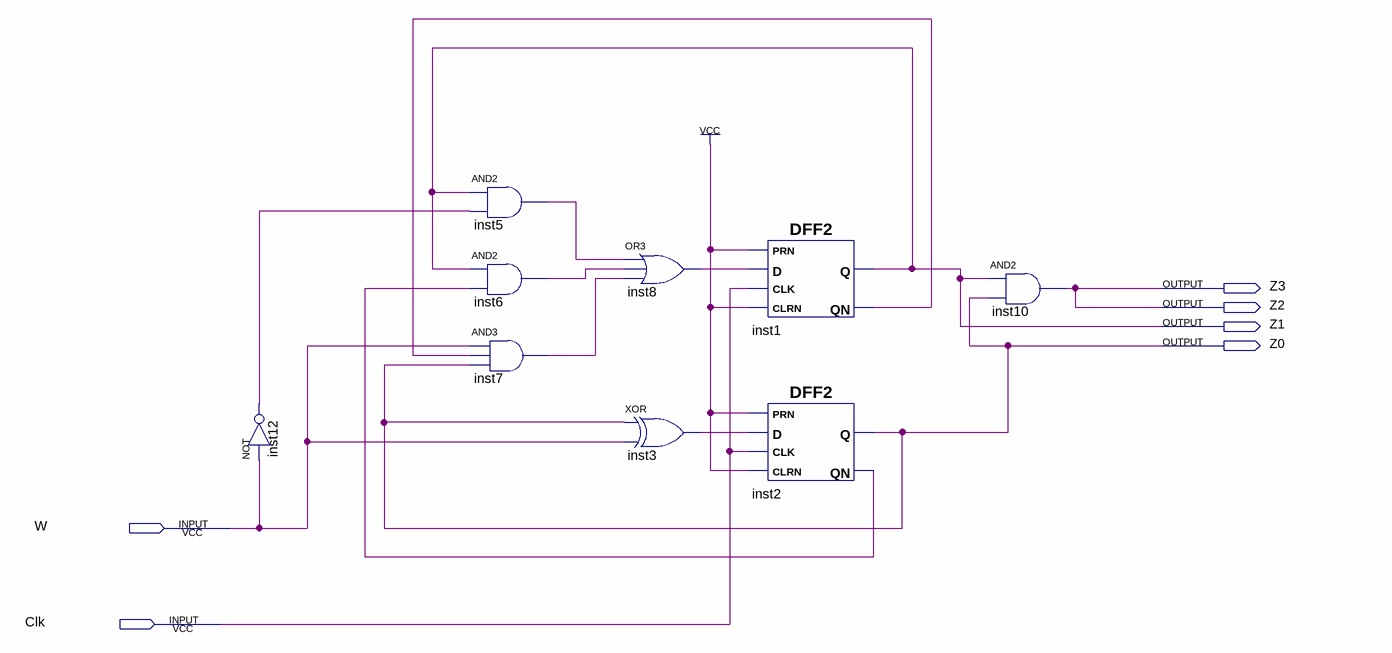
[diagram p0: schematic sheet]
// Quartus schematic readFSM.bdf as structural Verilog: 9 symbols, 6 pins
module readFSM (
  input  W,
  input  Clk,
  output Z3,
  output Z2,
  output Z1,
  output Z0
);

  wire inst1_qn, inst2_qn, inst3_out, inst5_out, inst6_out, inst7_out, inst8_out, inst12_out;

  not inst12 (inst12_out, W);
  and inst5 (inst5_out, Z1, inst12_out);
  and inst6 (inst6_out, Z1, inst2_qn);
  and inst7 (inst7_out, W, inst1_qn, Z0);
  or inst8 (inst8_out, inst5_out, inst6_out, inst7_out);
  xor inst3 (inst3_out, Z0, W);
  DFF2 inst1 (.CLK(Clk), .D(inst8_out), .PRN(1'b1), .CLRN(1'b1), .Q(Z1), .QN(inst1_qn));
  DFF2 inst2 (.CLK(Clk), .D(inst3_out), .PRN(1'b1), .CLRN(1'b1), .Q(Z0), .QN(inst2_qn));
  and inst10 (Z2, Z1, Z0);

  assign Z3 = Z2;
endmodule
